# Altium schematic sheet pqm_v2_page4.SchDoc
size A4
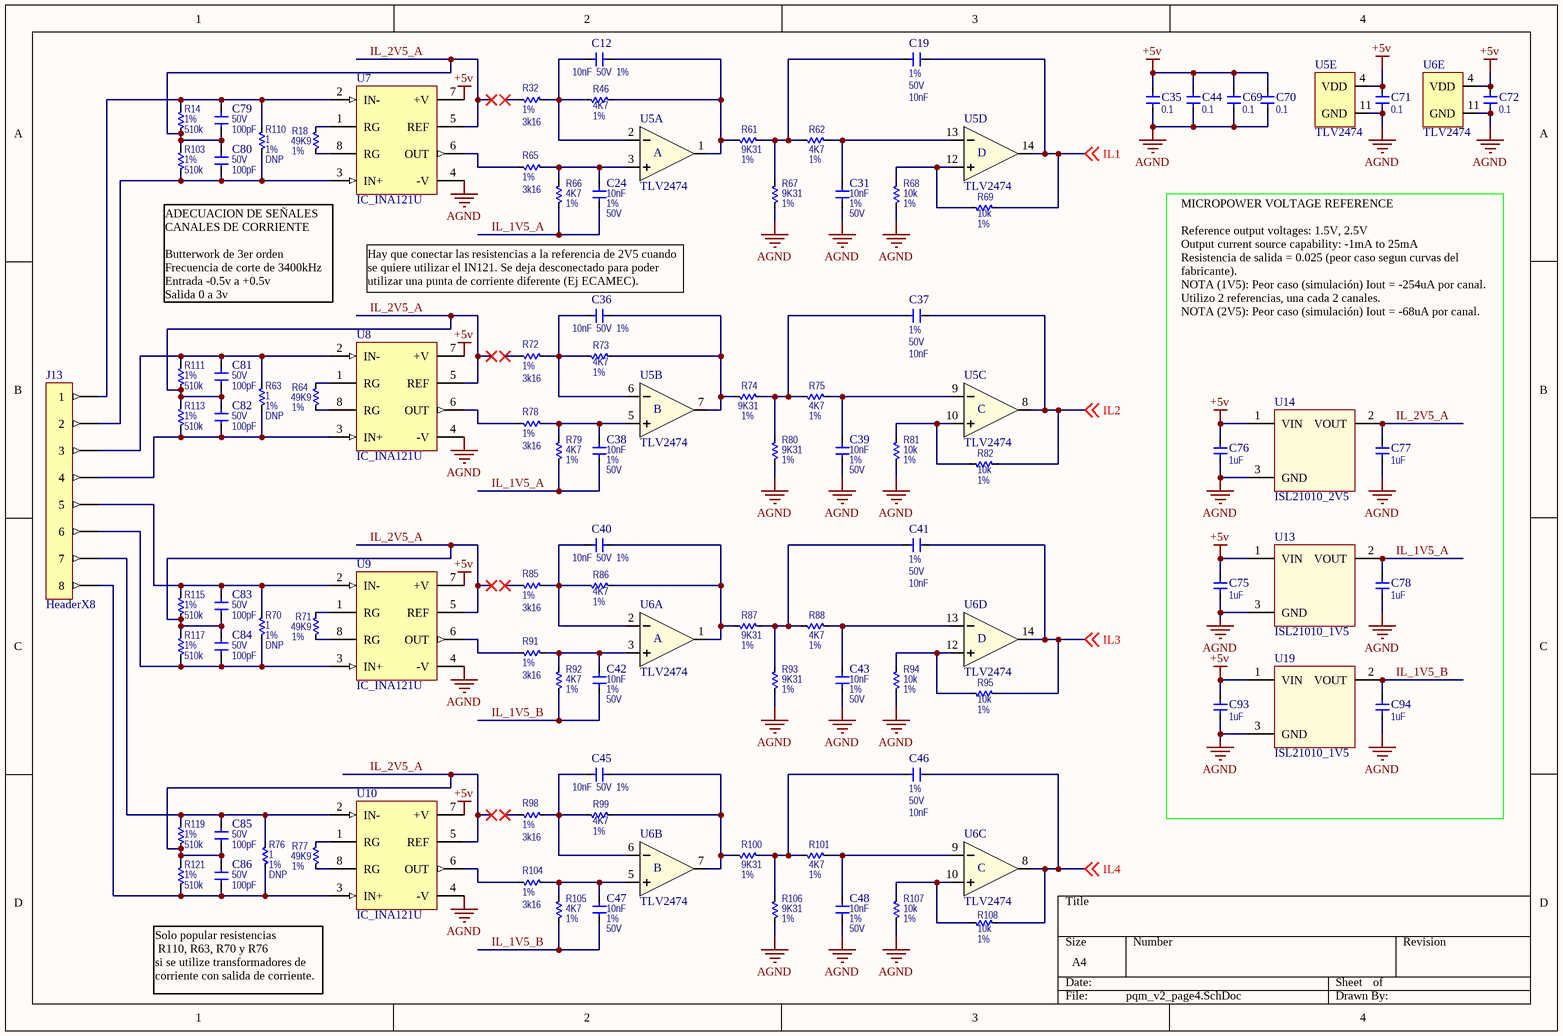
[diagram p0: pqm_v2_page4.SchDoc]

## Parts
C12  value 10nF  Tolerance: 1%  Voltage Rating: 50V  [CAPC2013X110N]  (hidden comment: CAP_GRM2195C1H103FA01D_MURATA)
C19  value 10nF  Tolerance: 1%  Voltage Rating: 50V  [CAPC2013X110N]  (hidden comment: CAP_GRM2195C1H103FA01D_MURATA)
C24  value 10nF  Tolerance: 1%  Voltage Rating: 50V  [CAPC2013X110N]  (hidden comment: CAP_GRM2195C1H103FA01D_MURATA)
C31  value 10nF  Tolerance: 1%  Voltage Rating: 50V  [CAPC2013X110N]  (hidden comment: CAP_GRM2195C1H103FA01D_MURATA)
C35  value 0.1  [CAPC2013X110N]  (hidden comment: CAP_CC0805KRX7R8BB104_YAGEO)
C36  value 10nF  Tolerance: 1%  Voltage Rating: 50V  [CAPC2013X110N]  (hidden comment: CAP_GRM2195C1H103FA01D_MURATA)
C37  value 10nF  Tolerance: 1%  Voltage Rating: 50V  [CAPC2013X110N]  (hidden comment: CAP_GRM2195C1H103FA01D_MURATA)
C38  value 10nF  Tolerance: 1%  Voltage Rating: 50V  [CAPC2013X110N]  (hidden comment: CAP_GRM2195C1H103FA01D_MURATA)
C39  value 10nF  Tolerance: 1%  Voltage Rating: 50V  [CAPC2013X110N]  (hidden comment: CAP_GRM2195C1H103FA01D_MURATA)
C40  value 10nF  Tolerance: 1%  Voltage Rating: 50V  [CAPC2013X110N]  (hidden comment: CAP_GRM2195C1H103FA01D_MURATA)
C41  value 10nF  Tolerance: 1%  Voltage Rating: 50V  [CAPC2013X110N]  (hidden comment: CAP_GRM2195C1H103FA01D_MURATA)
C42  value 10nF  Tolerance: 1%  Voltage Rating: 50V  [CAPC2013X110N]  (hidden comment: CAP_GRM2195C1H103FA01D_MURATA)
C43  value 10nF  Tolerance: 1%  Voltage Rating: 50V  [CAPC2013X110N]  (hidden comment: CAP_GRM2195C1H103FA01D_MURATA)
C44  value 0.1  [CAPC2013X110N]  (hidden comment: CAP_CC0805KRX7R8BB104_YAGEO)
C45  value 10nF  Tolerance: 1%  Voltage Rating: 50V  [CAPC2013X110N]  (hidden comment: CAP_GRM2195C1H103FA01D_MURATA)
C46  value 10nF  Tolerance: 1%  Voltage Rating: 50V  [CAPC2013X110N]  (hidden comment: CAP_GRM2195C1H103FA01D_MURATA)
C47  value 10nF  Tolerance: 1%  Voltage Rating: 50V  [CAPC2013X110N]  (hidden comment: CAP_GRM2195C1H103FA01D_MURATA)
C48  value 10nF  Tolerance: 1%  Voltage Rating: 50V  [CAPC2013X110N]  (hidden comment: CAP_GRM2195C1H103FA01D_MURATA)
C69  value 0.1  [CAPC2013X110N]  (hidden comment: CAP_CC0805KRX7R8BB104_YAGEO)
C70  value 0.1  [CAPC2013X110N]  (hidden comment: CAP_CC0805KRX7R8BB104_YAGEO)
C71  value 0.1  [CAPC2013X110N]  (hidden comment: CAP_CC0805KRX7R8BB104_YAGEO)
C72  value 0.1  [CAPC2013X110N]  (hidden comment: CAP_CC0805KRX7R8BB104_YAGEO)
C75  value 1uF  [CAPC2013X110N]  (hidden comment: CAP_CC0805KKX7R7BB105_YAGEO)
C76  value 1uF  [CAPC2013X110N]  (hidden comment: CAP_CC0805KKX7R7BB105_YAGEO)
C77  value 1uF  [CAPC2013X110N]  (hidden comment: CAP_CC0805KKX7R7BB105_YAGEO)
C78  value 1uF  [CAPC2013X110N]  (hidden comment: CAP_CC0805KKX7R7BB105_YAGEO)
C79  value 100pF  Voltage Rating: 50V  [CAPC2013X110N]  (hidden comment: CAP_CC0805JRNPO9BN101_YAGEO)
C80  value 100pF  Voltage Rating: 50V  [CAPC2013X110N]  (hidden comment: CAP_CC0805JRNPO9BN101_YAGEO)
C81  value 100pF  Voltage Rating: 50V  [CAPC2013X110N]  (hidden comment: CAP_CC0805JRNPO9BN101_YAGEO)
C82  value 100pF  Voltage Rating: 50V  [CAPC2013X110N]  (hidden comment: CAP_CC0805JRNPO9BN101_YAGEO)
C83  value 100pF  Voltage Rating: 50V  [CAPC2013X110N]  (hidden comment: CAP_CC0805JRNPO9BN101_YAGEO)
C84  value 100pF  Voltage Rating: 50V  [CAPC2013X110N]  (hidden comment: CAP_CC0805JRNPO9BN101_YAGEO)
C85  value 100pF  Voltage Rating: 50V  [CAPC2013X110N]  (hidden comment: CAP_CC0805JRNPO9BN101_YAGEO)
C86  value 100pF  Voltage Rating: 50V  [CAPC2013X110N]  (hidden comment: CAP_CC0805JRNPO9BN101_YAGEO)
C93  value 1uF  [CAPC2013X110N]  (hidden comment: CAP_CC0805KKX7R7BB105_YAGEO)
C94  value 1uF  [CAPC2013X110N]  (hidden comment: CAP_CC0805KKX7R7BB105_YAGEO)
J13  HeaderX8  [BorneraX8]
R14  value 510k  Tolerance: 1%  [RESC2013X065BN]  (hidden comment: RES_RC0805FR-07510KL_YAGEO)
R18  value 49K9  Tolerance: 1%  [RESC2013X065BN]  (hidden comment: RES_RC0805FR-0749K9L_YAGEO)
R32  value 3k16  Tolerance: 1%  [RESC2013X065BN]  (hidden comment: RES_RC0805FR-073K16L_YAGEO)
R46  value 4K7  Tolerance: 1%  [RESC2013X065BN]  (hidden comment: RES_RC0805FR-074K7L_YAGEO)
R61  value 9K31  Tolerance: 1%  [RESC2013X065BN]  (hidden comment: RES_RC0805FR-079K31L_YAGEO)
R62  value 4K7  Tolerance: 1%  [RESC2013X065BN]  (hidden comment: RES_RC0805FR-074K7L_YAGEO)
R63  value 1  Tolerance: 1%  [RESC2013X065BN]  (hidden comment: RES_RC0805FR-071RL_YAGEO)
R64  value 49K9  Tolerance: 1%  [RESC2013X065BN]  (hidden comment: RES_RC0805FR-0749K9L_YAGEO)
R65  value 3k16  Tolerance: 1%  [RESC2013X065BN]  (hidden comment: RES_RC0805FR-073K16L_YAGEO)
R66  value 4K7  Tolerance: 1%  [RESC2013X065BN]  (hidden comment: RES_RC0805FR-074K7L_YAGEO)
R67  value 9K31  Tolerance: 1%  [RESC2013X065BN]  (hidden comment: RES_RC0805FR-079K31L_YAGEO)
R68  value 10k  Tolerance: 1%  [RESC2013X065BN]  (hidden comment: RES_RC0805FR-0710KL_YAGEO)
R69  value 10k  Tolerance: 1%  [RESC2013X065BN]  (hidden comment: RES_RC0805FR-0710KL_YAGEO)
R70  value 1  Tolerance: 1%  [RESC2013X065BN]  (hidden comment: RES_RC0805FR-071RL_YAGEO)
R71  value 49K9  Tolerance: 1%  [RESC2013X065BN]  (hidden comment: RES_RC0805FR-0749K9L_YAGEO)
R72  value 3k16  Tolerance: 1%  [RESC2013X065BN]  (hidden comment: RES_RC0805FR-073K16L_YAGEO)
R73  value 4K7  Tolerance: 1%  [RESC2013X065BN]  (hidden comment: RES_RC0805FR-074K7L_YAGEO)
R74  value 9K31  Tolerance: 1%  [RESC2013X065BN]  (hidden comment: RES_RC0805FR-079K31L_YAGEO)
R75  value 4K7  Tolerance: 1%  [RESC2013X065BN]  (hidden comment: RES_RC0805FR-074K7L_YAGEO)
R76  value 1  Tolerance: 1%  [RESC2013X065BN]  (hidden comment: RES_RC0805FR-071RL_YAGEO)
R77  value 49K9  Tolerance: 1%  [RESC2013X065BN]  (hidden comment: RES_RC0805FR-0749K9L_YAGEO)
R78  value 3k16  Tolerance: 1%  [RESC2013X065BN]  (hidden comment: RES_RC0805FR-073K16L_YAGEO)
R79  value 4K7  Tolerance: 1%  [RESC2013X065BN]  (hidden comment: RES_RC0805FR-074K7L_YAGEO)
R80  value 9K31  Tolerance: 1%  [RESC2013X065BN]  (hidden comment: RES_RC0805FR-079K31L_YAGEO)
R81  value 10k  Tolerance: 1%  [RESC2013X065BN]  (hidden comment: RES_RC0805FR-0710KL_YAGEO)
R82  value 10k  Tolerance: 1%  [RESC2013X065BN]  (hidden comment: RES_RC0805FR-0710KL_YAGEO)
R85  value 3k16  Tolerance: 1%  [RESC2013X065BN]  (hidden comment: RES_RC0805FR-073K16L_YAGEO)
R86  value 4K7  Tolerance: 1%  [RESC2013X065BN]  (hidden comment: RES_RC0805FR-074K7L_YAGEO)
R87  value 9K31  Tolerance: 1%  [RESC2013X065BN]  (hidden comment: RES_RC0805FR-079K31L_YAGEO)
R88  value 4K7  Tolerance: 1%  [RESC2013X065BN]  (hidden comment: RES_RC0805FR-074K7L_YAGEO)
R91  value 3k16  Tolerance: 1%  [RESC2013X065BN]  (hidden comment: RES_RC0805FR-073K16L_YAGEO)
R92  value 4K7  Tolerance: 1%  [RESC2013X065BN]  (hidden comment: RES_RC0805FR-074K7L_YAGEO)
R93  value 9K31  Tolerance: 1%  [RESC2013X065BN]  (hidden comment: RES_RC0805FR-079K31L_YAGEO)
R94  value 10k  Tolerance: 1%  [RESC2013X065BN]  (hidden comment: RES_RC0805FR-0710KL_YAGEO)
R95  value 10k  Tolerance: 1%  [RESC2013X065BN]  (hidden comment: RES_RC0805FR-0710KL_YAGEO)
R98  value 3k16  Tolerance: 1%  [RESC2013X065BN]  (hidden comment: RES_RC0805FR-073K16L_YAGEO)
R99  value 4K7  Tolerance: 1%  [RESC2013X065BN]  (hidden comment: RES_RC0805FR-074K7L_YAGEO)
R100  value 9K31  Tolerance: 1%  [RESC2013X065BN]  (hidden comment: RES_RC0805FR-079K31L_YAGEO)
R101  value 4K7  Tolerance: 1%  [RESC2013X065BN]  (hidden comment: RES_RC0805FR-074K7L_YAGEO)
R103  value 510k  Tolerance: 1%  [RESC2013X065BN]  (hidden comment: RES_RC0805FR-07510KL_YAGEO)
R104  value 3k16  Tolerance: 1%  [RESC2013X065BN]  (hidden comment: RES_RC0805FR-073K16L_YAGEO)
R105  value 4K7  Tolerance: 1%  [RESC2013X065BN]  (hidden comment: RES_RC0805FR-074K7L_YAGEO)
R106  value 9K31  Tolerance: 1%  [RESC2013X065BN]  (hidden comment: RES_RC0805FR-079K31L_YAGEO)
R107  value 10k  Tolerance: 1%  [RESC2013X065BN]  (hidden comment: RES_RC0805FR-0710KL_YAGEO)
R108  value 10k  Tolerance: 1%  [RESC2013X065BN]  (hidden comment: RES_RC0805FR-0710KL_YAGEO)
R110  value 1  Tolerance: 1%  [RESC2013X065BN]  (hidden comment: RES_RC0805FR-071RL_YAGEO)
R111  value 510k  Tolerance: 1%  [RESC2013X065BN]  (hidden comment: RES_RC0805FR-07510KL_YAGEO)
R113  value 510k  Tolerance: 1%  [RESC2013X065BN]  (hidden comment: RES_RC0805FR-07510KL_YAGEO)
R115  value 510k  Tolerance: 1%  [RESC2013X065BN]  (hidden comment: RES_RC0805FR-07510KL_YAGEO)
R117  value 510k  Tolerance: 1%  [RESC2013X065BN]  (hidden comment: RES_RC0805FR-07510KL_YAGEO)
R119  value 510k  Tolerance: 1%  [RESC2013X065BN]  (hidden comment: RES_RC0805FR-07510KL_YAGEO)
R121  value 510k  Tolerance: 1%  [RESC2013X065BN]  (hidden comment: RES_RC0805FR-07510KL_YAGEO)
U5  value TLV2474  [SOIC127P600-14AN]  (hidden comment: IC_TLV2474_ANALOG)  (parts A,B,C,D,E of 5)
U6  value TLV2474  [SOIC127P600-14AN]  (hidden comment: IC_TLV2474_ANALOG)  (parts A,B,C,D,E of 5)
U7  IC_INA121U  [SOIC127P600-8BN]
U8  IC_INA121U  [SOIC127P600-8BN]
U9  IC_INA121U  [SOIC127P600-8BN]
U10  IC_INA121U  [SOIC127P600-8BN]
U13  ISL21010_1V5  [SOT23-3M]
U14  ISL21010_2V5  [SOT23-3M]
U19  ISL21010_1V5  [SOT23-3M]

## Nets
+5v: C35.1(T1) C44.1(T1) C69.1(T1) C70.1(T1) C71.1(T1) C72.1(T1) C75.1(T1) C76.1(T1) C93.1(T1) U5.4(VDD) U6.4(VDD) U7.7(+V) U8.7(+V) U9.7(+V) U10.7(+V) U13.1(VIN) U14.1(VIN) U19.1(VIN)
AGND: C31.1(T1) C35.2(T2) C39.1(T1) C43.1(T1) C44.2(T2) C48.1(T1) C69.2(T2) C70.2(T2) C71.2(T2) C72.2(T2) C75.2(T2) C76.2(T2) C77.2(T2) C78.2(T2) C93.2(T2) C94.2(T2) R67.1(T1) R68.2(T2) R80.1(T1) R81.2(T2) R93.1(T1) R94.2(T2) R106.1(T1) R107.2(T2) U5.11(GND) U6.11(GND) U7.4(-V) U8.4(-V) U9.4(-V) U10.4(-V) U13.3(GND) U14.3(GND) U19.3(GND)
IL1: C19.2(T2) R69.1(T1) U5.14(OUTD) ; off-sheet IL1
IL2: C37.2(T2) R82.1(T1) U5.8(OUTC) ; off-sheet IL2
IL3: C41.2(T2) R95.1(T1) U6.14(OUTD) ; off-sheet IL3
IL4: C46.2(T2) R108.1(T1) U6.8(OUTC) ; off-sheet IL4
IL_1V5_A: C24.1(T1) C38.1(T1) C78.1(T1) R66.2(T2) R79.2(T2) U13.2(VOUT)
IL_1V5_B: C42.1(T1) C47.1(T1) C94.1(T1) R92.2(T2) R105.2(T2) U19.2(VOUT)
IL_2V5_A: C77.1(T1) C79.2(T2) C80.1(T1) C81.2(T2) C82.1(T1) C83.2(T2) C84.1(T1) C85.2(T2) C86.1(T1) R14.1(T1) R103.2(T2) R111.1(T1) R113.2(T2) R115.1(T1) R117.2(T2) R119.1(T1) R121.2(T2) U7.5(REF) U8.5(REF) U9.5(REF) U10.5(REF) U14.2(VOUT)
NetC12_1: C12.1(T1) R32.1(T1) R46.2(T2) U5.2(INA-)
NetC12_2: C12.2(T2) R46.1(T1) R61.2(T2) U5.1(OUTA)
NetC19_1: C19.1(T1) R61.1(T1) R62.2(T2) R67.2(T2)
NetC24_2: C24.2(T2) R65.1(T1) R66.1(T1) U5.3(INA+)
NetC31_2: C31.2(T2) R62.1(T1) U5.13(IND-)
NetC36_1: C36.1(T1) R72.1(T1) R73.2(T2) U5.6(INB-)
NetC36_2: C36.2(T2) R73.1(T1) R74.2(T2) U5.7(OUTB)
NetC37_1: C37.1(T1) R74.1(T1) R75.2(T2) R80.2(T2)
NetC38_2: C38.2(T2) R78.1(T1) R79.1(T1) U5.5(INB+)
NetC39_2: C39.2(T2) R75.1(T1) U5.9(INC-)
NetC40_1: C40.1(T1) R85.1(T1) R86.2(T2) U6.2(INA-)
NetC40_2: C40.2(T2) R86.1(T1) R87.2(T2) U6.1(OUTA)
NetC41_1: C41.1(T1) R87.1(T1) R88.2(T2) R93.2(T2)
NetC42_2: C42.2(T2) R91.1(T1) R92.1(T1) U6.3(INA+)
NetC43_2: C43.2(T2) R88.1(T1) U6.13(IND-)
NetC45_1: C45.1(T1) R98.1(T1) R99.2(T2) U6.6(INB-)
NetC45_2: C45.2(T2) R99.1(T1) R100.2(T2) U6.7(OUTB)
NetC46_1: C46.1(T1) R100.1(T1) R101.2(T2) R106.2(T2)
NetC47_2: C47.2(T2) R104.1(T1) R105.1(T1) U6.5(INB+)
NetC48_2: C48.2(T2) R101.1(T1) U6.9(INC-)
NetC79_1: C79.1(T1) J13.1 R14.2(T2) R110.2(T2) U7.2(IN-)
NetC80_2: C80.2(T2) J13.2 R103.1(T1) R110.1(T1) U7.3(IN+)
NetC81_1: C81.1(T1) J13.3 R63.2(T2) R111.2(T2) U8.2(IN-)
NetC82_2: C82.2(T2) J13.4 R63.1(T1) R113.1(T1) U8.3(IN+)
NetC83_1: C83.1(T1) J13.5 R70.2(T2) R115.2(T2) U9.2(IN-)
NetC84_2: C84.2(T2) J13.6 R70.1(T1) R117.1(T1) U9.3(IN+)
NetC85_1: C85.1(T1) J13.7 R76.2(T2) R119.2(T2) U10.2(IN-)
NetC86_2: C86.2(T2) J13.8 R76.1(T1) R121.1(T1) U10.3(IN+)
NetR18_1: R18.1(T1) U7.8(RG)
NetR18_2: R18.2(T2) U7.1(RG)
NetR64_1: R64.1(T1) U8.8(RG)
NetR64_2: R64.2(T2) U8.1(RG)
NetR65_2: R65.2(T2) U7.6(OUT)
NetR68_1: R68.1(T1) R69.2(T2) U5.12(IND+)
NetR71_1: R71.1(T1) U9.8(RG)
NetR71_2: R71.2(T2) U9.1(RG)
NetR77_1: R77.1(T1) U10.8(RG)
NetR77_2: R77.2(T2) U10.1(RG)
NetR78_2: R78.2(T2) U8.6(OUT)
NetR81_1: R81.1(T1) R82.2(T2) U5.10(INC+)
NetR91_2: R91.2(T2) U9.6(OUT)
NetR94_1: R94.1(T1) R95.2(T2) U6.12(IND+)
NetR104_2: R104.2(T2) U10.6(OUT)
NetR107_1: R107.1(T1) R108.2(T2) U6.10(INC+)

Not connected (* = marked no-connect by the designer): R32 2(T2)*; R72 2(T2)*; R85 2(T2)*; R98 2(T2)*

## Notes on the sheet
- (near R110) DNP
- ADECUACION DE SEÑALES
  CANALES DE CORRIENTE
  Butterwork de 3er orden
  Frecuencia de corte de 3400kHz
  Entrada -0.5v a +0.5v
  Salida 0 a 3v
- (near C36) Hay que conectar las resistencias a la referencia de 2V5 cuando se quiere utilizar el IN121. Se deja desconectado para poder utilizar una punta de corriente diferente (Ej ECAMEC).
- MICROPOWER VOLTAGE REFERENCE
  Reference output voltages: 1.5V, 2.5V
  Output current source capability: -1mA to 25mA
  Resistencia de salida = 0.025 (peor caso segun curvas del fabricante).
  NOTA (1V5): Peor caso (simulación) Iout = -254uA por canal. Utilizo 2 referencias, una cada 2 canales.
  NOTA (2V5): Peor caso (simulación) Iout = -68uA por canal.
- (near R63) DNP
- (near R70) DNP
- (near R76) DNP
- Solo popular resistencias
  R110, R63, R70 y R76
  si se utilize transformadores de corriente con salida de corriente.
- (in symbol IC_TLV2474_ANALOG, part A) A
- (in symbol IC_TLV2474_ANALOG, part B) B
- (in symbol IC_TLV2474_ANALOG, part C) C
- (in symbol IC_TLV2474_ANALOG, part D) D

## Library data of the parts
C12 C19 C24 C31 C36-C43 C45-C48 = CAP_GRM2195C1H103FA01D_MURATA: CAP CER 10000PF 50V NP0 0805; Manufacturer: Murata Electronics North America; Supplier: *; Power Rating: *; BOM Populate: *; Digikey Part Number: 490-8295-1-ND; Mouser Part Number: 81-GRM2195C1H103FA1D; Manufacturer Part Number: GRM2195C1H103FA01D
C35 C44 C69-C72 = CAP_CC0805KRX7R8BB104_YAGEO: CAP CER 0.1UF 25V 10% X7R 0805; Manufacturer: Yageo; Supplier: *; Tolerance: 10%; Power Rating: *; Voltage Rating: 25V; BOM Populate: *; Digikey Part Number: 311-1141-1-ND; Mouser Part Number: 603-CC805KRX7R8BB104; Manufacturer Part Number: CC0805KRX7R8BB104
C75-C78 C93 C94 = CAP_CC0805KKX7R7BB105_YAGEO: CAP CER 1UF 16V X7R 0805; Manufacturer: YAGEO; Tolerance: 10%; Supplier: *; Supplier Part No: *; Power Rating: *; BOM Populate: *; Voltage Rating: 16V; Digikey Part Number: 311-1365-1-ND; Mouser Part Number: 603-CC805KKX7R7BB105; Manufacturer Part Number: CC0805KKX7R7BB105
C79-C86 = CAP_CC0805JRNPO9BN101_YAGEO: CAP CER 100PF 50V NPO 0805; Manufacturer: Yageo; Tolerance: 5%; Supplier: *; Power Rating: *; BOM Populate: *; Digikey Part Number: 311-1111-1-ND; Mouser Part Number: 603-CC805JRNPO9BN101; Manufacturer Part Number: CC0805JRNPO9BN101
J13 = CON_HeaderX8
R14 R103 R111 R113 R115 R117 R119 R121 = RES_RC0805FR-07510KL_YAGEO: RES SMD 510K OHM 1% 1/8W 0805; Manufacturer: Yageo; BOM Populate: *; Supplier Part No: *; Supplier: *; Digikey Part Number: 311-510KCRCT-ND; Power Rating: 1/8W; Manufacturer Part Number: RC0805FR-07510KL; Mouser Part Number: 603-RC0805FR-07510KL
R18 R64 R71 R77 = RES_RC0805FR-0749K9L_YAGEO: RES SMD 49.9K OHM 1% 1/8W 0805; Manufacturer: Yageo; BOM Populate: *; Supplier Part No: *; Supplier: *; Digikey Part Number: 311-49.9KCRCT-ND; Power Rating: 1/8W; Manufacturer Part Number: RC0805FR-0749K9L; Mouser Part Number: 603-RC0805FR-0749K9L
R32 R65 R72 R78 R85 R91 R98 R104 = RES_RC0805FR-073K16L_YAGEO: RES SMD 3.16K OHM 1% 1/8W 0805; Manufacturer: Yageo; BOM Populate: *; Supplier Part No: *; Supplier: *; Digikey Part Number: 311-3.16KCRCT-ND; Power Rating: 1/8W; Manufacturer Part Number: RC0805FR-073K16L; Mouser Part Number: 603-RC0805FR-073K16L
R46 R62 R66 R73 R75 R79 R86 R88 R92 R99 R101 R105 = RES_RC0805FR-074K7L_YAGEO: RES SMD 4.7K OHM 1% 1/8W 0805; Manufacturer: Yageo; BOM Populate: *; Supplier Part No: *; Supplier: *; Digikey Part Number: 311-4.70KCRCT-ND; Power Rating: 1/8W; Manufacturer Part Number: RC0805FR-074K7L; Mouser Part Number: 603-RC0805FR-074K7L
R61 R67 R74 R80 R87 R93 R100 R106 = RES_RC0805FR-079K31L_YAGEO: RES SMD 9.31K OHM 1% 1/8W 0805; Manufacturer: Yageo; BOM Populate: *; Supplier Part No: *; Supplier: *; Digikey Part Number: 311-9.31KCRCT-ND; Power Rating: 1/8W; Manufacturer Part Number: RC0805FR-079K31L; Mouser Part Number: 603-RC0805FR-079K31L
R63 R70 R76 R110 = RES_RC0805FR-071RL_YAGEO: RES SMD 1 OHM 1% 1/8W 0805; Manufacturer: Yageo; BOM Populate: *; Supplier Part No: *; Supplier: *; Digikey Part Number: 311-1.00CRCT-ND; Power Rating: 1/8W; Manufacturer Part Number: RC0805FR-071RL; Mouser Part Number: 603-RC0805FR-071RL
R68 R69 R81 R82 R94 R95 R107 R108 = RES_RC0805FR-0710KL_YAGEO: RES SMD 10K OHM 1% 1/8W 0805; Manufacturer: Yageo; BOM Populate: *; Supplier Part No: *; Supplier: *; Digikey Part Number: 311-10.0KCRCT-ND; Power Rating: 1/8W; Manufacturer Part Number: RC0805FR-0710KL; Mouser Part Number: 603-RC0805FR-0710KL
U5 U6 = IC_TLV2474_ANALOG: IC OPAMP GP 2.8MHZ RRO 14SOIC; Manufacturer: Texas Instrument; Manufacturer Part Number: TLV2474CDR; BOM_Populate: *; Digikey Part Number: 296-2442-1-ND; Mouser Part Number: 595-TLV2474CDR
U7-U10 = IC_INA121U: IC OPAMP INSTR 600KHZ 8SOIC; Manufacturer Part Number: INA121UA; Digikey Part Number: INA121UA-ND; Mouser Part Number: 595-INA121UA
U13 U19 = IC_ISL21010_1V5_INTERSIL: IC VREF SERIES 1.5V SOT23-3; Manufacturer Part Number: ISL21010CFH315Z-TK; Digikey Part Number: ISL21010CFH315Z-TKCT-ND; Mouser Part Number: 968-ISL21010CFH315ZT
U14 = IC_ISL21010_2V5_INTERSIL: IC VREF SERIES 2.5V SOT23-3; Manufacturer Part Number: ISL21010CFH325Z-TK; Digikey Part Number: ISL21010CFH325Z-TKCT-ND; Mouser Part Number: 968-ISL21010CFH325ZT